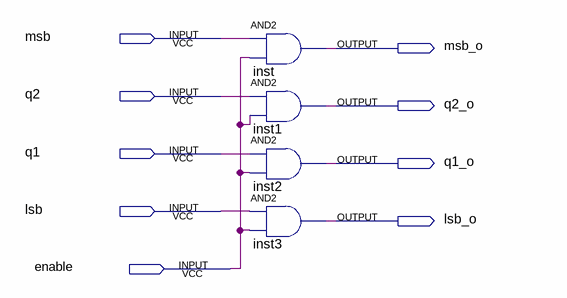
[diagram p0: schematic sheet]
// Quartus schematic enable.bdf as structural Verilog: 4 symbols, 9 pins
module enable (
  input  msb,
  input  q2,
  input  q1,
  input  lsb,
  input  enable,
  output msb_o,
  output q2_o,
  output q1_o,
  output lsb_o
);

  and inst (msb_o, msb, enable);
  and inst1 (q2_o, q2, enable);
  and inst2 (q1_o, q1, enable);
  and inst3 (lsb_o, lsb, enable);
endmodule
